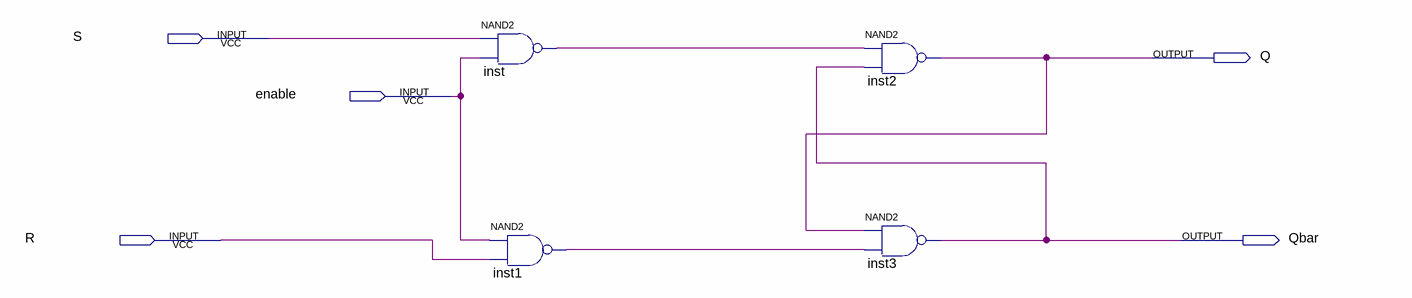
[diagram p0: schematic sheet]
// Quartus schematic dlatch_.bdf as structural Verilog: 4 symbols, 5 pins
module dlatch_ (
  input  S,
  input  enable,
  input  R,
  output Q,
  output Qbar
);

  wire inst1_out, inst_out;

  nand inst (inst_out, S, enable);
  nand inst1 (inst1_out, enable, R);
  nand inst2 (Q, inst_out, Qbar);
  nand inst3 (Qbar, Q, inst1_out);
endmodule
